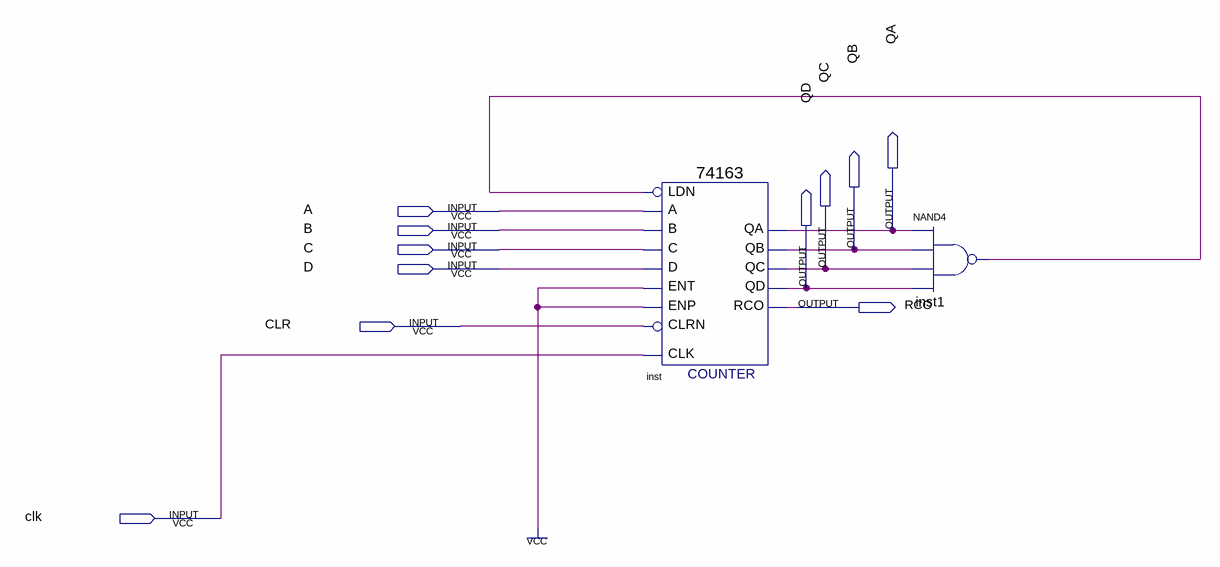
[diagram p0: schematic sheet]
// Quartus schematic count2.bdf as structural Verilog: 2 symbols, 11 pins
module count2 (
  input  A,
  input  B,
  input  C,
  input  D,
  input  CLR,
  input  clk,
  output QA,
  output QB,
  output QC,
  output QD,
  output RCO
);

  wire inst1_out;

  \74163  inst (
    .C(C), .B(B), .A(A), .ENT(1'b1), .D(D), .CLRN(CLR), .CLK(clk), .ENP(1'b1), .LDN(inst1_out), .QA(QA),
    .QB(QB), .QC(QC), .QD(QD), .RCO(RCO));
  nand inst1 (inst1_out, QA, QB, QC, QD);
endmodule
